# EAGLE design BUZZI-35 (EAGLE 4.15)
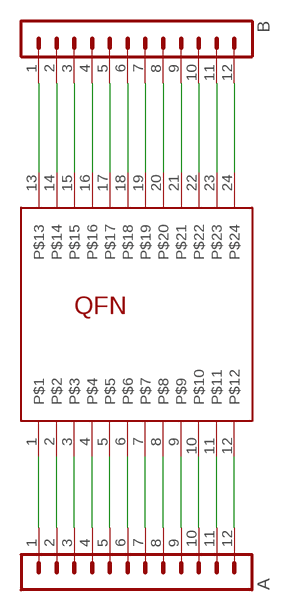
[diagram p0: schematic, sheet 1]

## Parts
A  MA12-1  [MA12-1]
B  MA12-1  [MA12-1]
QFN  GENERIC_QFN24  [HVQFN24]

## Nets
N$1: A.1 QFN.1
N$2: A.2 QFN.2
N$3: A.3 QFN.3
N$4: A.4 QFN.4
N$5: A.5 QFN.5
N$6: A.6 QFN.6
N$7: A.7 QFN.7
N$8: A.8 QFN.8
N$9: A.9 QFN.9
N$10: A.10 QFN.10
N$11: A.11 QFN.11
N$12: A.12 QFN.12
N$13: B.1 QFN.13
N$14: B.2 QFN.14
N$15: B.3 QFN.15
N$16: B.4 QFN.16
N$17: B.5 QFN.17
N$18: B.6 QFN.18
N$19: B.7 QFN.19
N$20: B.8 QFN.20
N$21: B.9 QFN.21
N$22: B.12 QFN.24
N$23: B.10 QFN.22
N$24: B.11 QFN.23

## Library data of the parts
A B = turbod3:MA12-1: PIN HEADER
QFN = turbod3:GENERIC_QFN24

## Net classes
0 default: width 0.1 mm

## Board
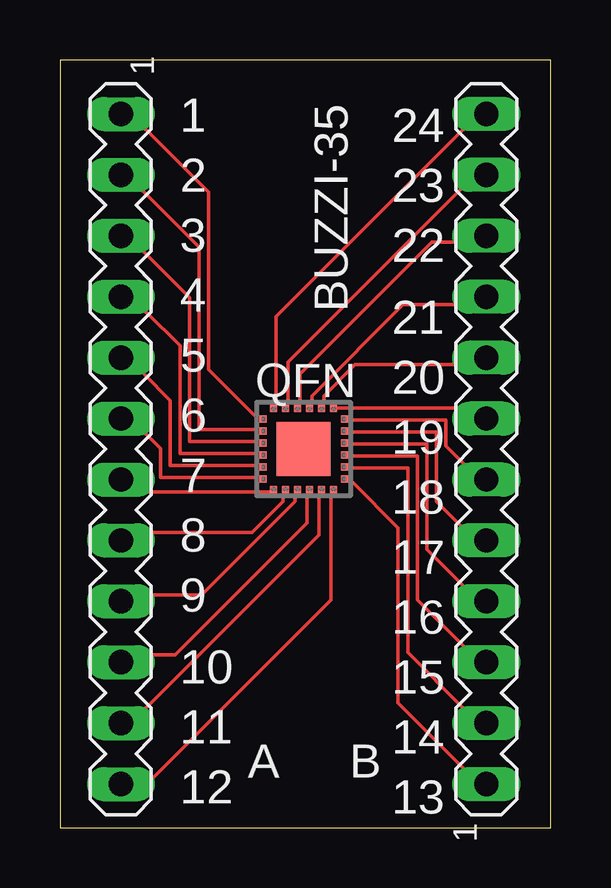
[diagram p1: board, top side]

Size 20.46 x 32 mm. Coordinates in mm from the lower left corner, seen from the top.
Outline: 0,0 20.46,0 20.46,32 0,32 0,0
Copper layers (1*16): Top 0.035mm / dielectric 1.5mm / Bottom 0.035mm
Design rules "PCB-POOL": minimum track width 6mil, minimum drill 12mil, track to track 6mil, track to pad 6mil, pad to pad 6mil, via to via 6mil, smd to smd 6mil, copper to edge 20mil, drill to drill 8mil, minimum pad ring 8mil, minimum via ring 6mil, stop-mask expansion 3mil, vias tented up to drill 0mil, thermal gap 8mil

### Footprints (pad centres in the part's own frame; a part is rotated, then mirrored left to right if it is on the bottom)
MA12-1 = drill 1.016 long: 1 -13.97,0; 2 -11.43,0; 3 -8.89,0; 4 -6.35,0; 5 -3.81,0; 6 -1.27,0; 7 1.27,0; 8 3.81,0; 9 6.35,0; 10 8.89,0; 11 11.43,0; 12 13.97,0
HVQFN24 = smd 0.5 x 0.3: 1 -1.8,1.25; 2 -1.8,0.75; 3 -1.8,0.25; 4 -1.8,-0.25; 5 -1.8,-0.75; 6 -1.8,-1.25; 13 1.8,-1.25; 14 1.8,-0.75; 15 1.8,-0.25; 16 1.8,0.25; 17 1.8,0.75; 18 1.8,1.25 | smd 0.3 x 0.5: 7 -1.25,-1.8; 8 -0.75,-1.8; 9 -0.25,-1.8; 10 0.25,-1.8; 11 0.75,-1.8; 12 1.25,-1.8; 19 1.25,1.8; 20 0.75,1.8; 21 0.25,1.8; 22 -0.25,1.8; 23 -0.75,1.8; 24 -1.25,1.8 | smd 2.25 x 2.25: TH 0,0

### Placement (x,y rotation side)
A  2.54,15.78 270 top
B  17.78,15.78 90 top
QFN  10.16,15.78 0 top

### Tracks (layer width: path | path; a pad name or v marks a point on that pad's centre or on a via)
N$1
  Top 0.152: QFN.1 8.2,17.1 6.2,19.1 6.2,26.5 3.6,29.1 A.1
N$2
  Top 0.152: QFN.2 8.2,16.6 5.8,16.6 5.8,24.2 3.5,26.5 A.2
N$3
  Top 0.152: QFN.3 8.2,16.1 5.4,16.1 5.4,22.1 3.5,24 A.3
N$4
  Top 0.152: QFN.4 8.2,15.6 5,15.6 5,20.1 3.6,21.5 A.4
N$5
  Top 0.152: QFN.5 8.2,15.1 4.6,15.1 4.6,17.8 3.5,18.9 A.5
N$6
  Top 0.152: QFN.6 8.2,14.6 4.2,14.6 4.2,15.8 3.6,16.4 A.6
N$7
  Top 0.152: QFN.7 8.8,14 3.7,14 A.7
N$8
  Top 0.152: QFN.8 9.3,13.8 9.3,13.6 8,12.3 3.9,12.3 A.8
N$9
  Top 0.152: QFN.9 9.8,13.8 9.8,13.6 5.9,9.7 3.9,9.7 A.9
N$10
  Top 0.152: QFN.10 10.3,13.8 10.3,12.7 4.8,7.2 3.9,7.2 A.10
N$11
  Top 0.152: QFN.11 10.8,13.8 10.8,12.2 3.6,5 A.11
N$12
  Top 0.152: QFN.12 11.3,13.8 11.3,9.5 3.9,2.1 A.12
N$13
  Top 0.152: QFN.13 12.2,14.4 14.1,12.5 14.1,5.2 16.8,2.5 B.1
N$14
  Top 0.152: QFN.14 12.2,15 14.5,15 14.5,7.3 16.8,5 B.2
N$15
  Top 0.152: QFN.15 12.2,15.5 14.9,15.5 14.9,9.5 16.8,7.6 B.3
N$16
  Top 0.152: QFN.16 12.2,16 15.3,16 15.3,11.6 16.8,10.1 B.4
N$17
  Top 0.152: QFN.17 12.2,16.5 15.7,16.5 15.7,13.6 16.7,12.6 B.5
N$18
  Top 0.152: QFN.18 12.2,17 16.1,17 16.1,15.9 16.8,15.2 B.6
N$19
  Top 0.152: QFN.19 11.5,17.5 16.6,17.5 B.7
N$20
  Top 0.152: QFN.20 11,17.8 11,18 12.3,19.3 16.4,19.3 B.8
N$21
  Top 0.152: QFN.21 10.5,17.8 10.5,18 14.3,21.8 16.4,21.8 B.9
N$22
  Top 0.152: QFN.24 9,17.8 9,21.3 16.8,29.1 B.12
N$23
  Top 0.152: QFN.22 10,17.8 10,18.9 15.5,24.4 16.4,24.4 B.10
N$24
  Top 0.152: QFN.23 9.5,17.8 9.5,19.4 16.7,26.6 B.11

### Text on the board
tNames: 24 | 1 | 23 | 2 | 22 | 3 | 4 | BUZZI-35 | 21 | 20 | 5 | 19 | 6 | 7 | 18 | 8 | 17 | 16 | 9 | 15 | 10 | 11 | 14 | 13 | 12